# Altium schematic sheet 超声波.SchDoc
size A4
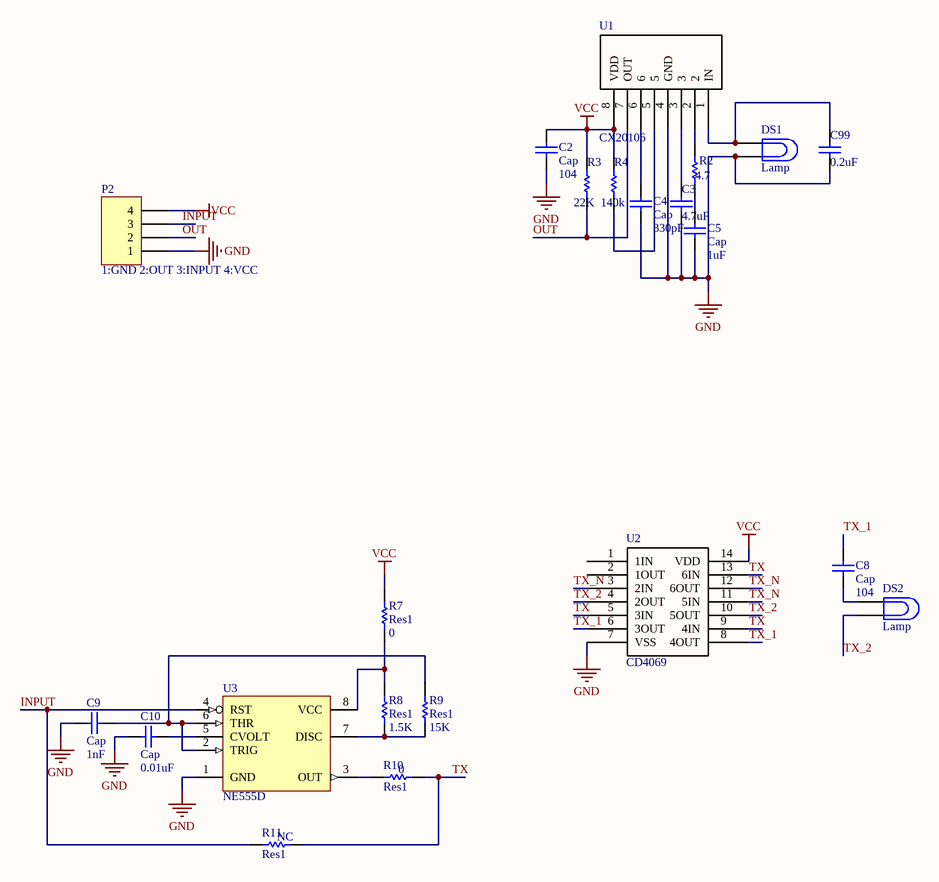
[diagram p0: 超声波.SchDoc]

## Parts
C2  Cap  value 104  [6-0805]
C3  value 4.7uF  [6-0805]
C4  Cap  value 330pF  [6-0805]
C5  Cap  value 1uF  [6-0805]
C8  Cap  value 104  [6-0805]
C9  Cap  value 1nF  [6-0805]
C10  Cap  value 0.01uF  [6-0805]
C99  value 0.2uF  [6-0805]
DS1  Lamp  [2pin_10mm]
DS2  Lamp  [2pin_10mm]
P2  1:GND 2:OUT 3:INPUT 4:VCC  [HDR1X4]
R2  value 4.7  [2012[0805]]
R3  value 22K  [2012[0805]]
R4  value 140k  [2012[0805]]
R7  Res1  value 0  [6-0805]
R8  Res1  value 1.5K  [6-0805]
R9  Res1  value 15K  [6-0805]
R10  Res1  value 0  [6-0805]
R11  Res1  value NC  [6-0805]
U1  CX20106  [HDR1X8]
U2  CD4069  [SOP-14]
U3  NE555D  [SO8_N]

## Nets
GND: C2.2 C3.2 C4.2 C5.2 C9.1 C10.1 C99.2 DS1.2 P2.1 U1.4(GND) U2.7(VSS) U3.1(GND)
VCC: C2.1 P2.4 R3.1 R4.1 R7.1 U1.8(VDD) U2.14(VDD)
INPUT: P2.3 R11.2 U3.4(RST)
OUT: P2.2 R3.2 U1.7(OUT)
TX: R10.1 R11.1 U2.5(3IN) U2.9(4IN) U2.13(6IN)
TX_1: C8.1 U2.6(3OUT) U2.8(4OUT)
TX_2: DS2.2 U2.4(2OUT) U2.10(5OUT)
TX_N: U2.3(2IN) U2.11(5IN) U2.12(6OUT)
NetC3_1: C3.1 U1.3
NetC4_1: C4.1 U1.6
NetC5_1: C5.1 R2.2
NetC8_2: C8.2 DS2.1
NetC9_2: C9.2 R9.1 U3.2(TRIG) U3.6(THR)
NetC10_2: C10.2 U3.5(CVOLT)
NetC99_1: C99.1 DS1.1 U1.1(IN)
NetR2_1: R2.1 U1.2
NetR4_2: R4.2 U1.5
NetR7_2: R7.2 R8.1 U3.8(VCC)
NetR8_2: R8.2 R9.2 U3.7(DISC)
NetR10_2: R10.2 U3.3(OUT)

Not connected (* = marked no-connect by the designer): U2 1(1IN) 2(1OUT)

## Library data of the parts
C2-C5 C8-C10 C99 = Cap: Capacitor; Published: 8-Jun-2000; LatestRevisionDate: 17-Jul-2002; LatestRevisionNote: Re-released for DXP Platform.; PackageReference: RAD-0.3; Publisher: Altium Limited
DS1 DS2 = Lamp: Incandescent Bulb; Published: 24-Mar-1999; LatestRevisionDate: 17-Jul-2002; LatestRevisionNote: Re-released for DXP Platform.; PackageReference: PIN2; Publisher: Altium Limited
P2 = Header 4: Header, 4-Pin; LatestRevisionDate: 17-Jul-2002; LatestRevisionNote: Re-released for DXP Platform.; Publisher: Altium Limited
R2-R4 R7-R11 = Res1: Resistor; Published: 8-Jun-2000; LatestRevisionDate: 17-Jul-2002; LatestRevisionNote: Re-released for DXP Platform.; PackageReference: AXIAL-0.3; Publisher: Altium Limited
U3 = NE555D: General-Purpose Single Bipolar Timer; Published: 24-Aug-2001; LatestRevisionDate: 13-Apr-2006; LatestRevisionNote: IPC-7351 Footprint Added.; DatasheetVersion: Jul-1998; PackageVersion: Dec-2002; PackageReference: SO8; Publisher: Altium Limited; PackageDescription: 8-Pin Small Outline Integrated Circuit 1.27 mm Pitch; Code_JEDEC: MS-012-AA; Code_IPC: SOIC127P600-8; ComponentLink1Description: Manufacturer Link; ComponentLink1URL: http://www.st.com/; ComponentLink2Description: Datasheet; ComponentLink2URL: http://www.st.com/stonline/products/literature/ds/2182/ne555.pdf